# EAGLE design Puzzle-loudness sensor (EAGLE 6.2)
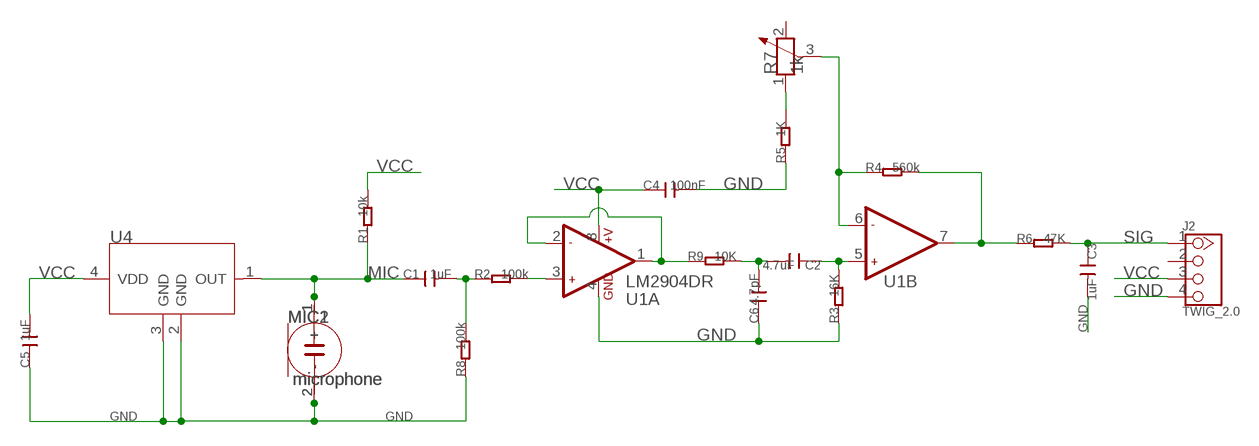
[diagram p0: schematic, sheet 1]

## Parts
C1  1uF  C-0603  [C0603]
C2  4.7uF  C-0805  [C0805]
C3  1uF  C-0603  [C0603]
C4  100nF  C-0603  [C0603]
C5  1uF  C-0603  [C0603]
C6  4.7pF  C-0603  [C0603]
J2  TWIG_2.0  [2.0_1X4]
MIC1  microphone  MICROPHONE  [2P-D8.9MM]
MIC2  microphone  MICROPHONE  [2P-D8.9MM]
R1  10k  R-0603  [R0603]
R2  100k  R-0603  [R0603]
R3  16K  R-0603  [R0603]
R4  560k  R-0603  [R0603]
R5  1K  R-0603  [R0603]
R6  47K  R-0603  [R0603]
R7  1k  R-POTENTIOMETER'3362'  [3P-SQUA-7X6.8]
R8  100k  R-0603  [R0603]
R9  10K  R-0603  [R0603]
U1  LM2904DR  LMV358D  [SO08]
U4  SENSOR-MULPS4CX  [4P-SMD-2.95X3.76X1.1H]

## Nets
GND: C3.2 C4.2 C5.1 C6.1 J2.4 MIC1.2(-) MIC2.2(-) R3.1 R5.1 R8.1 U1.4(A:GND) U4.2(GND) U4.3(GND)
MIC: C1.1 MIC1.1(+) MIC2.1(+) R1.1 U4.1(OUT)
N$1: R2.2 U1.3(A:+IN1)
N$2: C1.2 R2.1 R8.2
N$3: R9.1 U1.1(A:OUT1) U1.2(A:-IN1)
N$4: C2.1 R3.2 U1.5(B:+IN2)
N$5: R4.1 R7.3 U1.6(B:-IN2)
N$6: R4.2 R6.1 U1.7(B:OUT2)
N$7: R5.2 R7.1
N$9: C2.2 C6.2 R9.2
SIG: C3.1 J2.1 R6.2
VCC: C4.1 C5.2 J2.3 R1.2 U1.8(A:+V) U4.4(VDD)
Unconnected: J2.2 R7.2

## Library data of the parts
C1-C6 = Discrete:C*: Ceramic Capacitors
J2 = CONNECTER:TWIG_2.0
MIC1 MIC2 = template:MICROPHONE
R1-R6 R8 R9 = Discrete:R*
R7 = Discrete:R-POTENTIOMETER*: Potentiometer
U1 = IC:LMV358: General purpose LOW Voltage, Rail-to-Rail Output Amplifiers http://www.fairchildsemi.com/ds/LM/LMV358.pdf
U4 = template:SENSOR-MULPS4CX: Intergrated Ultra Low Pressure Sensor

## Board
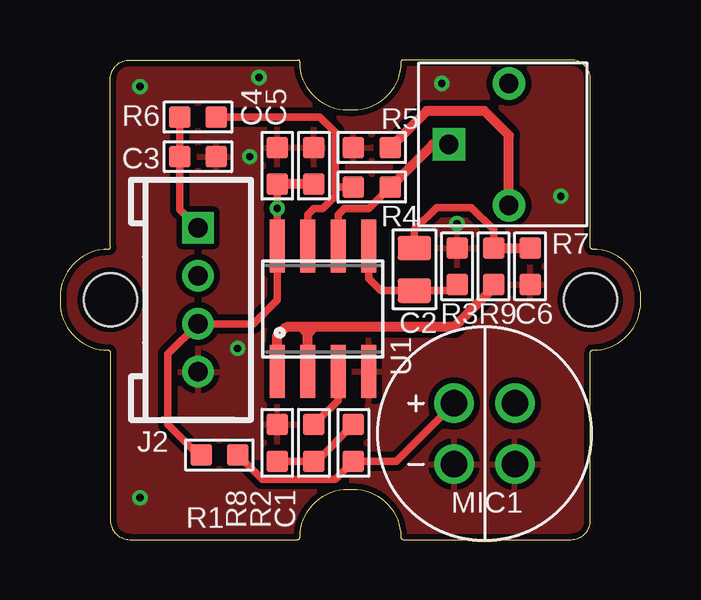
[diagram p1: board, top side]
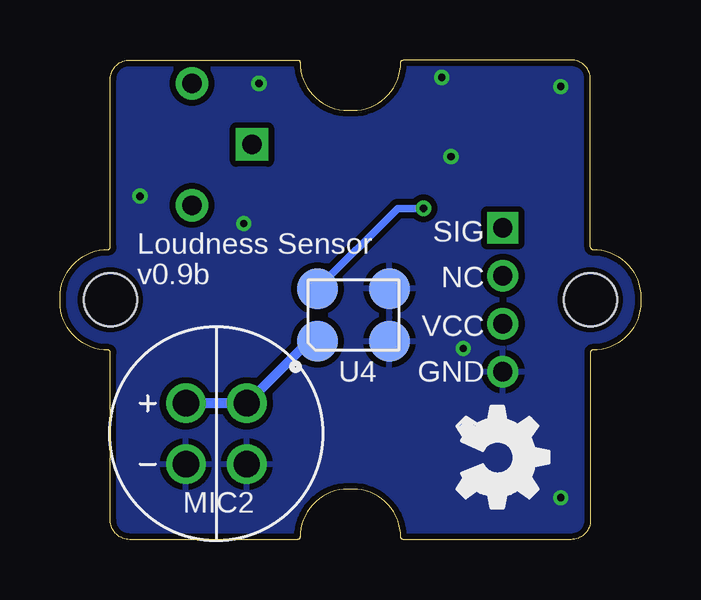
[diagram p2: board, bottom side, seen from below]

Size 24.2 x 20 mm. Coordinates in mm from the lower left corner, seen from the top.
Copper layers (1*16): Top 0.035mm / dielectric 1.5mm / Bottom 0.035mm
Design rules: minimum track width 6mil, minimum drill 12mil, track to track 6mil, track to pad 6mil, pad to pad 6mil, via to via 6mil, smd to smd 0mil, copper to edge 10mil, drill to drill 10mil, minimum pad ring 10mil, minimum via ring 6mil, stop-mask expansion 2mil, vias tented up to drill 100mil, thermal gap 10mil

### Footprints (pad centres in the part's own frame; a part is rotated, then mirrored left to right if it is on the bottom)
C0603 = smd 0.889 x 0.889: 1 -0.762,0; 2 0.762,0
C0805 = smd 1.016 x 1.397: 1 -0.889,0; 2 0.889,0
2.0_1X4 = drill 0.8 pad 1.27 square: 1 -3,0 | drill 0.8 pad 1.27: 2 -1,0; 3 1,0; 4 3,0
2P-D8.9MM = drill 1.1: 1 -1.27,1.27; 2 -1.27,-1.27
R0603 = smd 0.889 x 0.889: 1 -0.762,0; 2 0.762,0
3P-SQUA-7X6.8 = drill 0.8 pad 1.35: 1 -2.54,-0.25; 2 2.54,-0.25 | drill 0.8 pad 1.35 square: 3 0,2.25
SO08 = smd 0.61 x 2.21: 1 -1.905,-2.616; 2 -0.635,-2.616; 3 0.635,-2.616; 4 1.905,-2.616; 5 1.905,2.616; 6 0.635,2.616; 7 -0.635,2.616; 8 -1.905,2.616
4P-SMD-2.95X3.76X1.1H = smd 1.7 x 1.7: 1 -1.1,1.5; 2 -1.1,-1.5; 3 1.1,-1.5; 4 1.1,1.5
1U-DIM-W/-DRILL = hole 2.2: 0,-10; 0,10

### Placement (x,y rotation side)
C1  12.23,4.03 90 top
C2  14.77,11.27 90 top
C3  5.75,15.97 0 top
C4  9.05,15.59 90 top
C5  10.58,15.59 270 top
C6  19.59,11.4 90 top
J2  5.75,10 270 top
MIC1  17.69,4.41 0 top
MIC2  17.69,4.41 0 bottom
R1  6.64,3.52 180 top
R2  10.58,4.03 90 top
R3  16.55,11.4 270 top
R4  12.99,14.7 180 top
R5  12.99,16.35 0 top
R6  5.75,17.62 180 top
R7  18.45,16.48 90 top
R8  9.05,4.03 270 top
R9  18.07,11.4 90 top
U1  10.96,9.62 0 top
U4  11.97,9.37 90 bottom
U$1  [OSHW_FILLX150_NOTEXT]  7.65,5.55 270 bottom
U$2  [1U-DIM-W/-DRILL]  12.1,10 90 top

### Tracks (layer width: path | path; a pad name or v marks a point on that pad's centre or on a via)
GND  (via drill 0.3 pad 0.64)
  other vias: 7.4,7.97 8.29,19.27 3.34,18.89 15.91,19.02 20.86,14.32 3.34,1.74 7.91,15.97 16.55,13.18
  pour Top (isolate 0.254): -0.09,-0.16 24.29,-0.16 24.29,20.16 -0.09,20.16
  pour Bottom (isolate 0.254): -0.09,-0.16 24.29,-0.16 24.29,20.16 -0.09,20.16
MIC
  Top 0.305: MIC1.1 14,3.27 C1.1 11.46,2.51 8.42,2.51 R1.1
  Bottom 0.406: U4.1 13.83,8.27 MIC1.1 MIC2.1
N$1
  Top 0.305: U1.3 11.59,5.81 R2.2
N$2
  Top 0.203: R2.1 10.7,3.27
  Top 0.305: 10.7,3.27 C1.2 | R8.2 R2.1
N$3
  Top 0.406: R9.1 18.07,10.51 16.42,8.86 10.58,8.86 | 10.58,8.86 10.32,8.86 | 10.32,8.86 10.07,8.86 | 10.07,8.86 9.43,8.86 9.05,8.48 U1.1 | U1.2 10.32,8.6 | 10.32,8.6 10.32,8.86 | 10.07,8.86 10.32,8.6 | 10.32,8.6 10.58,8.86
N$4
  Top 0.305: R3.2 16.29,10.38 C2.1 13.37,10.38 12.86,10.89 U1.5
N$5
  Top 0.305: U1.6 11.59,13.56 11.85,13.81 12.86,13.81 R4.1
  Top 0.406: R7.3 15.53,16.48 R4.1
N$6
  Top 0.305: U1.7 10.32,13.56 10.58,13.81 10.96,13.81 11.46,14.32 11.46,14.57 | 11.46,14.57 11.46,14.7 | 11.46,14.7 11.46,14.83 | 11.46,14.83 11.46,16.98 10.83,17.62 R6.1 | R4.2 11.59,14.7 | 11.59,14.7 11.46,14.7 | 11.46,14.83 11.59,14.7 | 11.46,14.57 11.59,14.7
N$7
  Top 0.406: R7.1 18.7,16.86 17.69,17.87 15.27,17.87 R5.2
N$9
  Top 0.305: R9.2 18.07,12.92 17.14,13.85 15.69,13.85 14.77,12.92 C2.2
  Top 0.406: R9.2 C6.2 19.72,12.16
SIG
  Top 0.305: R6.2 C3.1 4.99,13.76 J2.1
VCC  (via drill 0.3 pad 0.64)
  Top 0.254: C4.1 9.18,14.83
  Top 0.305: C4.1 v9.05,13.81 U1.8 8.93,12.11 8.93,11.4 9.05,11.27 9.05,10 8.05,9 J2.3 4.48,7.73 4.48,4.79 5.75,3.52 R1.2
  Top 0.406: C5.2 9.18,14.83
  Bottom 0.305: v9.05,13.81 10.13,13.81 U4.4

### Text on the board
bPlace: SIG | Loudness Sensor | NC | v0.9b | VCC | GND